# Altium project PCBA-2121-01-B02.PrjPcb
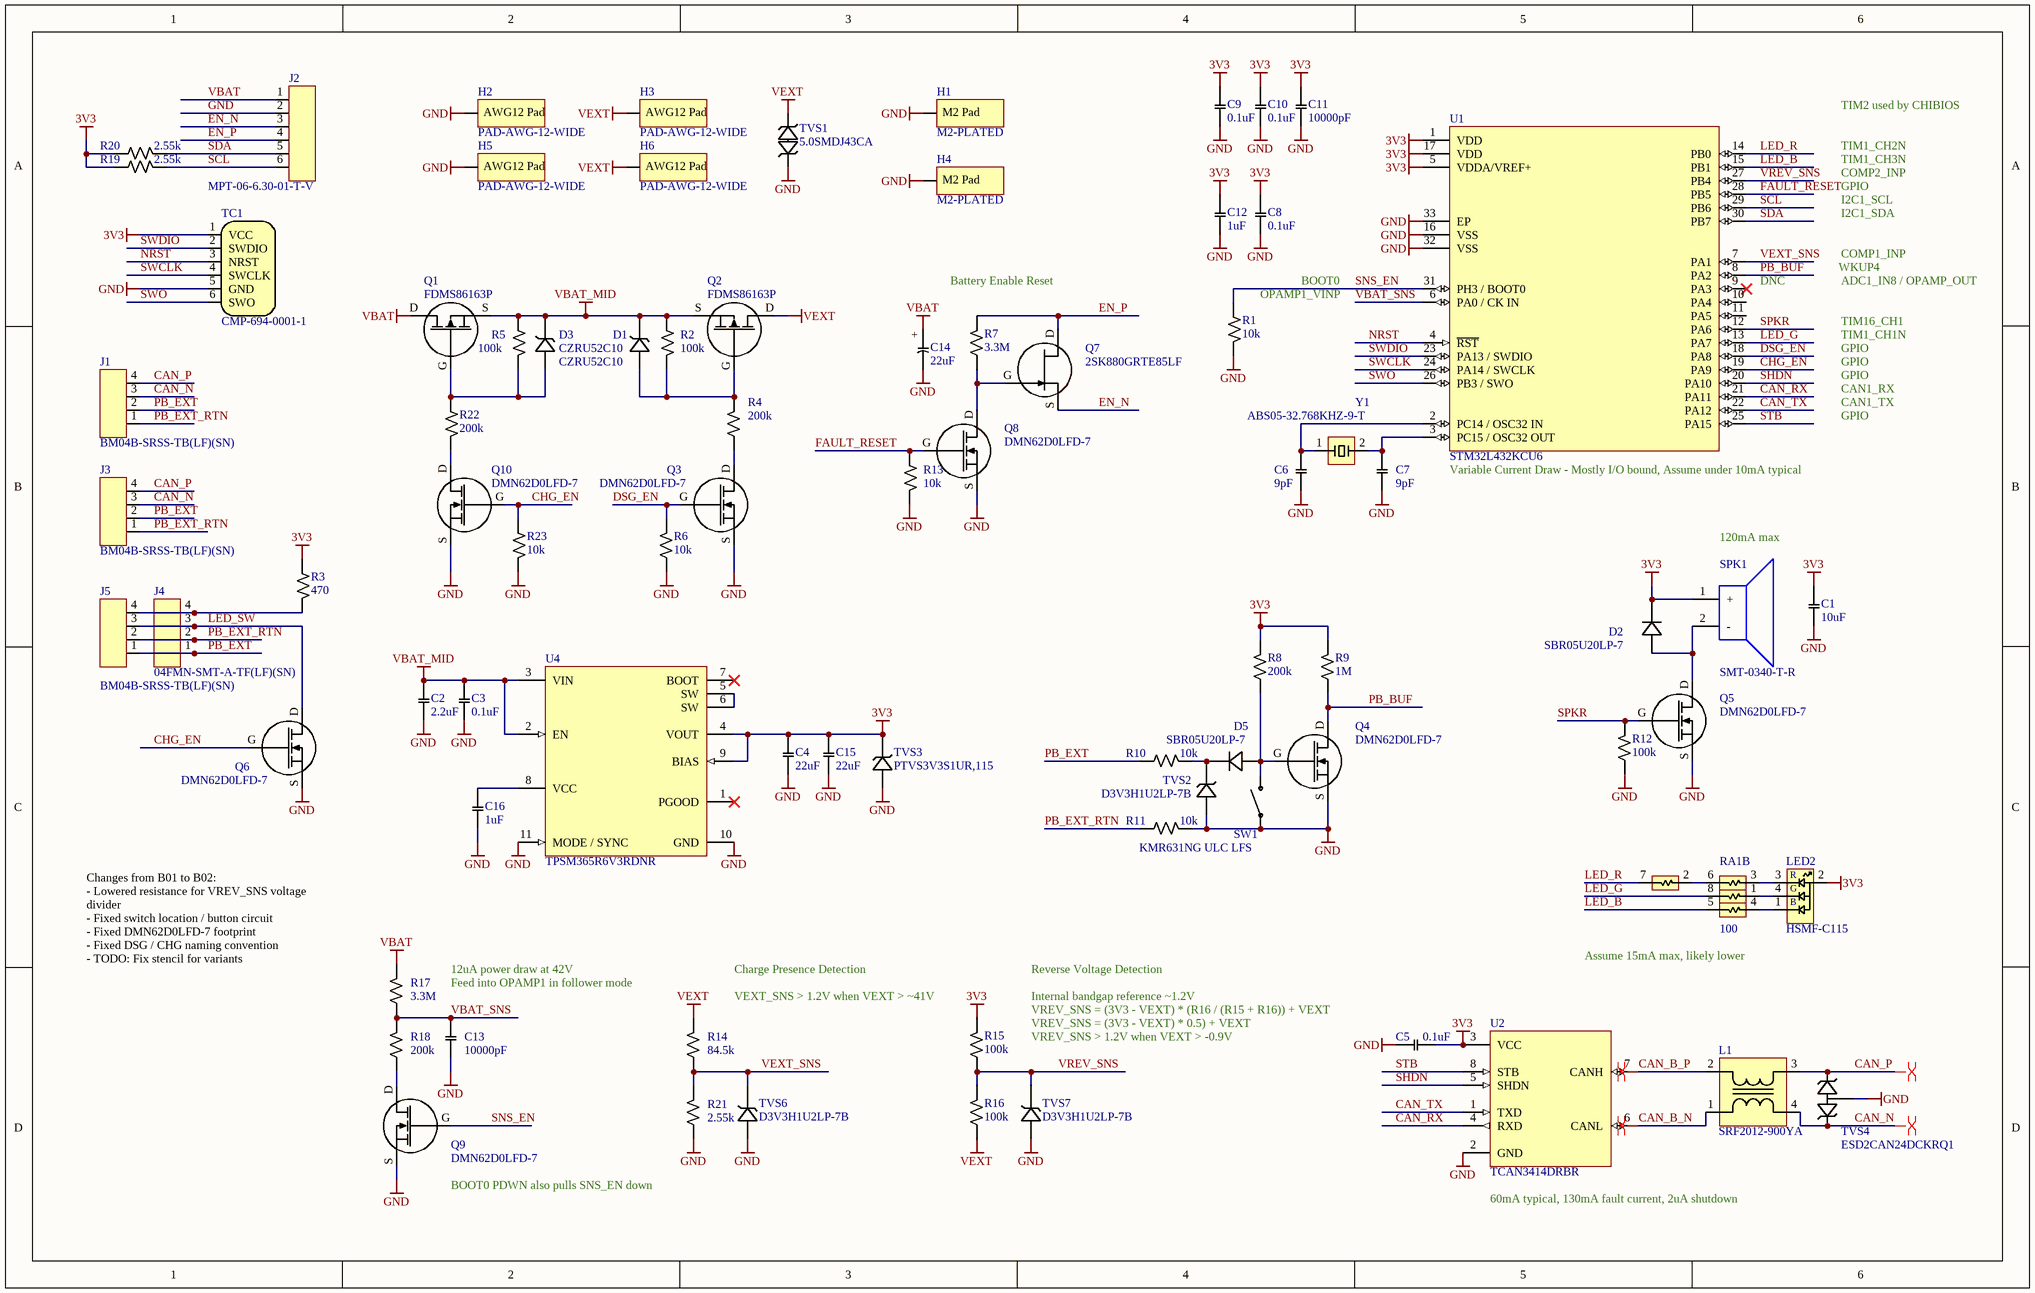
[diagram p0: PCBA-2121-01.SchDoc]
board_revision: rev A01; part_number: PE-XXXX-01
1 sheet, 80 parts. Net scope: global (net labels, ports and power ports of the same name join across sheets).
Board files: PCBA-2121-01.PcbDoc, PANEL-PCBA-2121-01.PcbDoc, PCBA-2121-01_tabbed.PcbDoc, PCBA-2121-01_v_cut.PcbDoc

## Sheet PCBA-2121-01.SchDoc
size B; Organization: Hebi Robotics; Address1: Suite 780; Address2: 5001 Baum Blvd; Address3: Pittsburgh, PA 15213; Address4: USA

### Parts
C1  Capacitance: 10uF  [C0603]  (hidden comment: C-10uf-X5R-16V-10%-0603)
C2  Capacitance: 2.2uF  [C1206]  (hidden comment: C-2.2uf-X7R-100V-10%-1206)
C3  Capacitance: 0.1uF  [C0603]  (hidden comment: C-0.1uf-X7R-100V-10%-0603)
C4  Capacitance: 22uF  [C1206]  (hidden comment: C-22uf-X5R-25V-20%-1206)
C5  Capacitance: 0.1uF  [C0402]  (hidden comment: C-0.1uf-X7R-25V-10%-0402)
C6  Capacitance: 9pF  [C0402]  (hidden comment: C-9pf-NP0-50V-0.1pF-0402)
C7  Capacitance: 9pF  [C0402]  (hidden comment: C-9pf-NP0-50V-0.1pF-0402)
C8  Capacitance: 0.1uF  [C0402]  (hidden comment: C-0.1uf-X7R-25V-10%-0402)
C9  Capacitance: 0.1uF  [C0402]  (hidden comment: C-0.1uf-X7R-25V-10%-0402)
C10  Capacitance: 0.1uF  [C0402]  (hidden comment: C-0.1uf-X7R-25V-10%-0402)
C11  Capacitance: 10000pF  [C0402]  (hidden comment: C-10000pf-X7R-50V-10%-0402)
C12  Capacitance: 1uF  [C0402]  (hidden comment: C-1uf-X5R-25V-10%-0402)
C13  Capacitance: 10000pF  [C0402]  (hidden comment: C-10000pf-X7R-50V-10%-0402)
C14  Capacitance: 22uF  [CAPAE5753X61L]  (hidden comment: UCM1H220MCL1GS)
C15  Capacitance: 22uF  [C1206]  (hidden comment: C-22uf-X5R-25V-20%-1206)
C16  Capacitance: 1uF  [C0402]  (hidden comment: C-1uf-X5R-25V-10%-0402)
D1  CZRU52C10  [CZRU52C10]
D2  SBR05U20LP-7  [DFN1006-2_DIODES]
D3  CZRU52C10  [CZRU52C10]
D5  SBR05U20LP-7  [DFN1006-2_DIODES]
H1  M2-PLATED  [M2-PLATED-NORMAL]  (no BOM)
H2  PAD-AWG-12-WIDE  [AWG-12-With-Wire]  (no BOM)
H3  PAD-AWG-12-WIDE  [AWG-12-With-Wire]  (no BOM)
H4  M2-PLATED  [M2-PLATED-NORMAL]  (no BOM)
H5  PAD-AWG-12-WIDE  [AWG-12-With-Wire]  (no BOM)
H6  PAD-AWG-12-WIDE  [AWG-12-With-Wire]  (no BOM)
J1  BM04B-SRSS-TB(LF)(SN)  [BM04B-SRSS-TB]
J2  MPT-06-6.30-01-T-V  [MPT-06-6.30-01-T-V-Footprint-1]
J3  BM04B-SRSS-TB(LF)(SN)  [BM04B-SRSS-TB]
J4  04FMN-SMT-A-TF(LF)(SN)  [04FMN-SMT-A-TF(LF)(SN)-Footprint-1]
J5  BM04B-SRSS-TB(LF)(SN)  [BM04B-SRSS-TB]
L1  SRF2012-900YA  [FP-SRF2012A-MFG]
LED2  HSMF-C115  [HSMF-C115]
Q1  FDMS86163P  [FDMS86300DC]
Q2  FDMS86163P  [FDMS86300DC]
Q3  DMN62D0LFD-7  [DMN62D0LFD-7-Footprint-1]
Q4  DMN62D0LFD-7  [DMN62D0LFD-7-Footprint-1]
Q5  DMN62D0LFD-7  [DMN62D0LFD-7-Footprint-1]
Q6  DMN62D0LFD-7  [DMN62D0LFD-7-Footprint-1]
Q7  2SK880GRTE85LF  [SOT65P205X100-3L]
Q8  DMN62D0LFD-7  [DMN62D0LFD-7-Footprint-1]
Q9  DMN62D0LFD-7  [DMN62D0LFD-7-Footprint-1]
Q10  DMN62D0LFD-7  [DMN62D0LFD-7-Footprint-1]
R1  Resistance: 10k  [R0402]  (hidden comment: R-10k-1%-0.063w-0402)
R2  Resistance: 100k  [R0402]  (hidden comment: R-100k-1%-0.063w-0402)
R3  Resistance: 470  [R0402]  (hidden comment: R-470-1%-0.063w-0402)
R4  Resistance: 200k  [R0402]  (hidden comment: R-200k-1%-0.063w-0402)
R5  Resistance: 100k  [R0402]  (hidden comment: R-100k-1%-0.063w-0402)
R6  Resistance: 10k  [R0402]  (hidden comment: R-10k-1%-0.063w-0402)
R7  Resistance: 3.3M  [R0402]  (hidden comment: R-3.3M-1%-0.063w-0402)
R8  Resistance: 200k  [R0402]  (hidden comment: R-200k-1%-0.063w-0402)
R9  Resistance: 1M  [R0402]  (hidden comment: R-1M-1%-0.063w-0402)
R10  Resistance: 10k  [R0402]  (hidden comment: R-10k-1%-0.063w-0402)
R11  Resistance: 10k  [R0402]  (hidden comment: R-10k-1%-0.063w-0402)
R12  Resistance: 100k  [R0402]  (hidden comment: R-100k-1%-0.063w-0402)
R13  Resistance: 10k  [R0402]  (hidden comment: R-10k-1%-0.063w-0402)
R14  Resistance: 84.5k  [R0402]  (hidden comment: R-84.5k-1%-0.063w-0402)
R15  Resistance: 100k  [R0402]  (hidden comment: R-100k-1%-0.063w-0402)
R16  Resistance: 100k  [R0402]  (hidden comment: R-100k-1%-0.063w-0402)
R17  Resistance: 3.3M  [R0402]  (hidden comment: R-3.3M-1%-0.063w-0402)
R18  Resistance: 200k  [R0402]  (hidden comment: R-200k-1%-0.063w-0402)
R19  Resistance: 2.55k  [R0402]  (hidden comment: R-2.55k-1%-0.063w-0402)
R20  Resistance: 2.55k  [R0402]  (hidden comment: R-2.55k-1%-0.063w-0402)
R21  Resistance: 2.55k  [R0402]  (hidden comment: R-2.55k-1%-0.063w-0402)
R22  Resistance: 200k  [R0402]  (hidden comment: R-200k-1%-0.063w-0402)
R23  Resistance: 10k  [R0402]  (hidden comment: R-10k-1%-0.063w-0402)
RA1  RA-4-C-100-5%-0.063w-0804  [741C083]  (value not drawn)  (parts A,B,C,D of 4)
SPK1  SMT-0340-T-R  [SMT-0340-T-R]
SW1  KMR631NG ULC LFS  [KMR6_CK]
TC1  CMP-694-0001-1  [TC2030-MCP-NL_SMALL]  (no BOM)
TVS1  5.0SMDJ43CA  [DIOM6959X26L]
TVS2  D3V3H1U2LP-7B  [DFN70P101X53-2N]
TVS3  PTVS3V3S1UR,115  [SOD-123W_NXP]
TVS4  ESD2CAN24DCKRQ1  [SOT65P210X90-3L]
TVS6  D3V3H1U2LP-7B  [DFN70P101X53-2N]
TVS7  D3V3H1U2LP-7B  [DFN70P101X53-2N]
U1  STM32L432KCU6  [QFN50P500X500X60_HS-33L]
U2  TCAN3414DRBR  [SON65P300X100_HS-9L]
U4  TPSM365R6V3RDNR  [TPSM365R6V3RDNR-Footprint-1]
Y1  ABS05-32.768KHZ-9-T  [ABS05-32.768KHZ-9-T-Footprint-1]

### Nets
3V3: C1.1 C4.2 C5.2 C8.2 C9.2 C10.2 C11.2 C12.1 C15.2 D2.C LED2.2(A) R3.1 R8.2 R9.2 R15.2 R19.1 R20.1 SPK1.1(+) TC1.1(VCC) TVS3.C U1.1(VDD) U1.5(VDDA/VREF+) U1.17(VDD) U2.3(VCC) U4.4(VOUT) U4.9(BIAS)
GND: C1.2 C2.1 C3.1 C4.1 C5.1 C6.1 C7.1 C8.1 C9.1 C10.1 C11.1 C12.2 C13.2 C14.- C15.1 C16.1 H1.HOLE H2.HOLE H4.HOLE H5.HOLE J2.2 Q3.S Q4.S Q5.S Q6.S Q8.S Q9.S Q10.S R1.2 R6.1 R11.2 R12.1 R13.2 R21.1 R23.1 SW1.1 TC1.5(GND) TVS1.C TVS2.A TVS3.A TVS4.3 TVS6.A TVS7.A U1.16(VSS) U1.32(VSS) U1.33(EP) U2.2(GND) U4.10(GND) U4.11(MODE_/_SYNC)
VBAT: C14.+ J2.1 Q1.D R17.2
VBAT_MID: C2.2 C3.2 D1.C D3.C Q1.S Q2.S R2.1 R5.1 U4.2(EN) U4.3(VIN)
VEXT: H3.HOLE H6.HOLE Q2.D R14.2 R16.1 TVS1.A
CAN_B_N: L1.1 U2.6(CANL)
CAN_B_P: L1.2 U2.7(CANH)
CAN_N: J1.3 J3.3 L1.4 TVS4.2
CAN_P: J1.4 J3.4 L1.3 TVS4.1
CAN_RX: U1.21(PA11) U2.4(RXD)
CAN_TX: U1.22(PA12) U2.1(TXD)
CHG_EN: Q6.G Q10.G R23.2 U1.19(PA9)
DSG_EN: Q3.G R6.2 U1.18(PA8)
EN_N: J2.3 Q7.S
EN_P: J2.4 Q7.D R7.2
FAULT_RESET: Q8.G R13.1 U1.28(PB5)
LED_B: RA1.5 U1.15(PB1)
LED_G: RA1.8 U1.13(PA7)
LED_R: RA1.7 U1.14(PB0)
LED_SW: J4.3 J5.3 Q6.D
NRST: TC1.3(NRST) U1.4(~{RST})
PB_BUF: Q4.D R9.1 U1.8(PA2)
PB_EXT: J1.2 J3.2 J4.1 J5.1 R10.1
PB_EXT_RTN: J1.1 J3.1 J4.2 J5.2 R11.1
SCL: J2.6 R19.2 U1.29(PB6)
SDA: J2.5 R20.2 U1.30(PB7)
SHDN: U1.20(PA10) U2.5(SHDN)
SNS_EN: Q9.G R1.1 U1.31(PH3_/_BOOT0)
SPKR: Q5.G R12.2 U1.12(PA6)
STB: U1.25(PA15) U2.8(STB)
SWCLK: TC1.4(SWCLK) U1.24(PA14_/_SWCLK)
SWDIO: TC1.2(SWDIO) U1.23(PA13_/_SWDIO)
SWO: TC1.6(SWO) U1.26(PB3_/_SWO)
VBAT_SNS: C13.1 R17.1 R18.2 U1.6(PA0_/_CK_IN)
VEXT_SNS: R14.1 R21.2 TVS6.C U1.7(PA1)
VREV_SNS: R15.1 R16.2 TVS7.C U1.27(PB4)
NetC6_2: C6.2 U1.2(PC14_/_OSC32_IN) Y1.1
NetC7_2: C7.2 U1.3(PC15_/_OSC32_OUT) Y1.2
NetC16_2: C16.2 U4.8(VCC)
NetD1_A: D1.A Q2.G R2.2 R4.2
NetD2_A: D2.A Q5.D SPK1.2(-)
NetD3_A: D3.A Q1.G R5.2 R22.2
NetD5_A: D5.A Q4.G R8.1 SW1.2
NetD5_C: D5.C R10.2 TVS2.C
NetJ4_4: J4.4 J5.4 R3.2
NetLED2_1: LED2.1(CR) RA1.4
NetLED2_3: LED2.3(CB) RA1.3
NetLED2_4: LED2.4(CG) RA1.1
NetQ3_D: Q3.D R4.1
NetQ7_G: Q7.G Q8.D R7.1
NetQ9_D: Q9.D R18.1
NetQ10_D: Q10.D R22.1
NetRA1_2: RA1.2 RA1.6
NetU4_5: U4.5(SW) U4.6(SW)

Not connected (* = marked no-connect by the designer): U1 9(PA3)* 10(PA4) 11(PA5); U4 1(PGOOD)* 7(BOOT)*

### Layout directives
differential pair: CAN_B_N, CAN_B_P, CAN_N, CAN_P

### Notes on the sheet
- TIM1_CH3N
- TIM1_CH2N
- TIM2 used by CHIBIOS
- I2C1_SCL
- I2C1_SDA
- COMP2_INP
- GPIO
- Battery Enable Reset
- BOOT0
- OPAMP1_VINP
- (near U1) DNC
- ADC1_IN8 / OPAMP_OUT
- COMP1_INP
- WKUP4
- TIM1_CH1N
- TIM16_CH1
- CAN1_RX
- CAN1_TX
- (near U1) Variable Current Draw - Mostly I/O bound, Assume under 10mA typical
- 120mA max
- 12uA power draw at 42V
- Charge Presence Detection
- Reverse Voltage Detection
- Assume 15mA max, likely lower
- Feed into OPAMP1 in follower mode
- VEXT_SNS > 1.2V when VEXT > ~41V
- VREV_SNS > 1.2V when VEXT > -0.9V
- VREV_SNS = (3V3 - VEXT) * (R16 / (R15 + R16)) + VEXT
- VREV_SNS = (3V3 - VEXT) * 0.5) + VEXT
- Internal bandgap reference ~1.2V
- Changes from B01 to B02:
  - Lowered resistance for VREV_SNS voltage divider
  - Fixed switch location / button circuit
  - Fixed DMN62D0LFD-7 footprint
  - Fixed DSG / CHG naming convention
  - TODO: Fix stencil for variants
- (near Q9) BOOT0 PDWN also pulls SNS_EN down
- (near U2) 60mA typical, 130mA fault current, 2uA shutdown
- Title
- Size:
- Date:
- Tabloid
- Number:
- Time:
- Revision:
- Sheet
- of
- File:
- (in symbol CMP-00909-1) R; G; B

### Library data of the parts
C1 = CMP-00102-2: Capacitor Ceramic 10uF 16V X5R 10% SMD 0603; Tolerance: 10%; Voltage - Rated: 16V; Package / Case: 0603; Operating Temperature: -55°C ~ 85°C; Temperature Coefficient: X5R
C2 = CMP-01086-1: Capacitor Ceramic 2.2uF 100V X7R 10% SMD 1206; Package / Case: 1206; Voltage - Rated: 100V; Operating Temperature: -55°C ~ 125°C; Temperature Coefficient: X7R; Tolerance: ±10%
C3 = C-0.1uf-X7R-100V-20%-0603-6: Capacitor Ceramic 0.1uF 100V X7R 10% SMD 0603; Operating Temperature: -55°C ~ 125°C; Voltage - Rated: 100V; Tolerance: ±10%; Temperature Coefficient: X7R; Package / Case: 0603
C4 C15 = CMP-00094-2: Capacitor Ceramic 22uF 25V X5R 20% SMD 1206; Package / Case: 1206; Voltage - Rated: 25V; Tolerance: 20%; Operating Temperature: -55°C ~ 85°C; Temperature Coefficient: X5R
C5 C8-C10 = CMP-00040-11: Capacitor Ceramic 0.1uF 25V X7R 10% SMD 0402; Voltage - Rated: 25V; Package / Case: 0402; Operating Temperature: -55°C ~ 125°C; Temperature Coefficient: X7R; Tolerance: 10%
C6 C7 = CMP-01105-1: Capacitor Ceramic 9pF 50V NP0 ±0.1pF SMD 0402; Temperature Coefficient: C0G, NP0; Package / Case: 0402; Operating Temperature: -55°C ~ 125°C; Tolerance: ±0.1pF; Voltage - Rated: 50V
C11 C13 = CMP-00041-8: Capacitor Ceramic 10000pF 50V X7R 10% SMD 0402; Voltage - Rated: 50V; Operating Temperature: -55°C ~ 125°C; Tolerance: 10%; Temperature Coefficient: X7R; Package / Case: 0402
C12 C16 = C-1uf-X5R-25V-10%-0402-8: Capacitor Ceramic 1uF 25V X5R 10% SMD 0402; Tolerance: ±10%; Voltage - Rated: 25V; Package / Case: 0402; Operating Temperature: -55°C ~ 85°C; Temperature Coefficient: X5R
C14 = CMP-01106-1: CAP ALUM 22UF 20% 50V SMD; Capacitor Type: Aluminium; Tolerance: 20%; Voltage: 50V
D1 D3 = CMP-00843-2: DIODE ZENER 10V 150MW 0603; Test Current: 5mA; Diode Element Material: SILICON; Number of Terminals/Pins: 2; Number of Elements: 1; Voltage Tol-Max: 5%; Package Body Material: Plastic; Time @ Peak Reflow Temperature-Max (s): 30s; Polarity: Unidirectional; Min Operating Temperature: -55°C; Max Power Dissipation: 150mW; RoHS Compliant: Yes; Max Operating Temperature: 125°C; Reference Voltage-Nom: 10V; Terminal Finish: Gold; Terminal Position: DUAL; Terminal Form: No Lead; Package Shape: Rectangular; Surface Mount: Yes; Diode Type: ZENER; Peak Reflow Temperature (Cel): 260°C; Technology: ZENER; REACH SVHC: Yes; JESD-609 Code: e4; Package Style: SMALL OUTLINEMeter
D2 D5 = CMP-698-0003-3: DIODE SBR 20V 500MA 2DFN; Speed: Fast Recovery =< 500ns, > 200mA (Io); Voltage - Forward (Vf) (Max) @ If: 500mV @ 500mA; Current - Reverse Leakage @ Vr: 50µA @ 20V; Diode Type: Super Barrier; Supplier Device Package: 2-DFN1006 (1.0x0.6); Current - Average Rectified (Io): 500mA; Lead Free Status / RoHS Status: RoHS Compliant; Category: Discrete Semiconductor Products; ComponentLink1URL: http://www.diodes.com/datasheets/SBR05U20LP.pdf; ComponentLink1Description: Datasheet; Mounting Type: Surface Mount; Capacitance @ Vr, F: -; Reverse Recovery Time (trr): -; Voltage - DC Reverse (Vr) (Max): 20V; Operating Temperature - Junction: -65°C ~ 150°C; Package / Case: 2-UFDFN
H1 H4 = CMP-00782-1: M2 Size Screw Hole, Normal Fit, Plated; Size: M2
H2 H3 H5 H6 = CMP-01047-1: AWG 12 Hole with Wider Pad; Size: AWG12
J1 J3 = CMP-00286-2: CONN HEADER SH 4POS TOP 1MM TIN; Manufacturer: JST Sales America Inc; Connector Type: Header, Shrouded; Number of Positions Loaded: All; Number of Positions: 4; Pitch: 0.039" (1.00mm); Features: Solder Retention; Mounting Type: Surface Mount; Color: Natural; Contact Finish: Tin; Row Spacing: -; ComponentLink1URL: http://www.jst-mfg.com/product/pdf/eng/eSH.pdf; Contact Mating Length: -; ComponentLink1Description: Datasheet; Contact Finish Thickness: -; Manufacturer Part Number: BM04B-SRSS-TB(LF)(SN); Number of Rows: 1; Category: Connectors, Interconnects; Lead Free Status / RoHS Status: RoHS Compliant; Contact Type: Male Pin; Termination: Solder; Fastening Type: -
J2 = CMP-00921-2: 5.00 MM POWERSTRIP/30 A DUAL BL; Number of Terminals/Pins: 36; Number of Ports: 1; Number of Contacts: 6; Voltage Rating: 812V; Gender: Male; Contact Plating: Tin; Housing Material: Polymer; Series: PowerStrip™ 30 MPT; Packaging: Tray; Number of Positions: 6; Termination: Solder; Number of Rows: 1; Mount: Through Hole; Insulation Material: Polymer; Contact Material: Copper Alloy; Length: 37.55mm; Orientation: Straight; Fastening Type: Ramp; Max Operating Temperature: 105°C; Min Operating Temperature: -55°C; Depth: 12.45mm; RoHS Compliant: Yes; Number of Pins: 36; Color: Black; Radiation Hardening: No
J4 = CMP-1199-000014-1: Ffc / Fpc Board Connector, Fmn Series, Surface Mount, Receptacle, 4, 1 Mm Rohs Compliant: Yes; Max Current Rating: 500mA; Number of Positions: 4; Pitch: 1mm; Max Voltage Rating (DC): 50V; Max Operating Temperature: 85°C; Orientation: Right Angle; Min Operating Temperature: -25°C; Mounting Technology: Surface Mount
J5 = CMP-00286-2: CONN HEADER SH 4POS TOP 1MM TIN; Manufacturer: JST Sales America Inc; Connector Type: Header, Shrouded; Number of Positions: 4; Number of Positions Loaded: All; Pitch: 0.039" (1.00mm); Manufacturer Part Number: BM04B-SRSS-TB(LF)(SN); Lead Free Status / RoHS Status: RoHS Compliant; ComponentLink1Description: Datasheet; ComponentLink1URL: http://www.jst-mfg.com/product/pdf/eng/eSH.pdf; Category: Connectors, Interconnects; Contact Type: Male Pin; Number of Rows: 1; Mounting Type: Surface Mount; Termination: Solder; Features: Solder Retention; Contact Finish: Tin; Color: Natural; Contact Mating Length: -; Fastening Type: -; Row Spacing: -; Contact Finish Thickness: -
L1 = CMP-01087-1: CMC 400MA 2LN 90 OHM SMD; DC Resistance-Max: 300mR; Filter Type: DATA LINE FILTER; Voltage Rating: 50V; Output Impedance: 90R; Width: 1.2mm; Current Rating: 400mA; Mounting Technology: Surface Mount; Length: 2mm; RoHS Compliant: Yes; Height: 1.2mm; Min Operating Temperature: -40°C; Max Operating Temperature: 125°C; Reach SVHC Compliant: Yes
LED2 = CMP-00909-1: LED RGB DIFFUSED CHIP SMD R/A; Test Current: 20mA; Dominant Wavelength: 470nm; Viewing Angle: 125°; Number of LEDs: 3; Power Rating: 78mW; Reverse Voltage: 5V; Lens Color: White; Lens Style: Diffused,Dome,Colorless,Rectangular; Color: Blue,Green,Red; Luminous Intensity: 60mcd; Forward Voltage: 3.4V; RoHS Compliant: Yes; Height: 1mm; Mount: Surface Mount; Min Operating Temperature: -40°C; Forward Current: 20mA; Radiation Hardening: No; Wavelength: 470nm; Number of Pins: 4; Lens Transparency: Diffused; Package Quantity: 3000; REACH SVHC: No SVHC; Width: 1mm; Contact Plating: Gold; Case/Package: SMD/SMT; Lead Free: Lead Free; Length: 2.5mm; Depth: 1mm; Number of Elements: 3; Max Operating Temperature: 85°C; Packaging: Tape and Reel; Series: -
Q1 Q2 = CMP-00940-2: MOSFET P-CH 100V 7.9A POWER56; Drain to Source Voltage (Vdss): -100V; Continuous Drain Current (ID): -50A; Drain to Source Resistance: 22mR; Element Configuration: Single; Gate to Source Voltage (Vgs): 25V; Max Power Dissipation: 104W; Threshold Voltage: -2.8V; Height: 1.05mm; Length: 5mm; Max Operating Temperature: 150°C; Min Operating Temperature: -55°C; Rds On Max: 22mR; Width: 5.85mm
Q3-Q6 Q8-Q10 = CMP-01107-2: MOSFET N-CH 60V 310MA 3DFN
Q7 = CMP-01103-1: JFET N-CH 50V SC70
R1 R6 R10 R11 R13 R23 = CMP-00015-10: Resistor 0402 10k Ohm 1% 1-16 Watt; Power: 0.063W, 1/16W; Package: 0402; Tolerance: 1%
R2 R5 R12 R15 R16 = CMP-00014-5: Resistor 0402 100k Ohm 1% 1-16 Watt; Power: 0.063W, 1/16W; Package: 0402; Tolerance: 1%
R3 = CMP-00097-2: Resistor 0402 470 Ohm 1% 1-16 Watt; Power: 0.063W, 1/16W; Package: 0402; Tolerance: 1%
R4 R8 R18 R22 = CMP-00010-6: Resistor 0402 200k Ohm 1% 1-16 Watt; Power: 0.063W, 1/16W; Tolerance: 1%; Package: 0402
R7 R17 = CMP-00141-5: Resistor 0402 3.3M Ohm 1% 1-16 Watt; Power: 0.063W, 1/16W; Package / Case: 0402; Tolerance (%): ±1%
R9 = CMP-00025-6: Resistor 0402 1M Ohm 1% 1-16 Watt; Power: 0.063W, 1/16W; Package: 0402; Tolerance: 1%
R14 = CMP-00979-1: Resistor 0402 84.5k Ohm 1% 1-16 Watt; Part Name: R-82k-1%-0.063w-0402; Power: 0.063W, 1/16W; Package / Case: 0402; Tolerance (%): ±1%
R19-R21 = CMP-00113-3: Resistor 0402 2.55k Ohm 1% 1-16 Watt; Power: 0.063W, 1/16W; Tolerance (%): ±1%; Package / Case: 0402; Part Name: R-2.55k-1%-0.063w-0402
RA1 = CMP-340-0000-6: 100 ohm Resistor Array 4 Element Concave 5%  1-16Watt 0804; Circuit Type: Isolated; Number of Resistors: 4; Power: 0.063W; Resistance: 100; Number of Pins: 4; Package / Case: 0804, Concave, Long Side Terminals; Part Name: RA-4-C-100-5%-0.063w-0804; Tolerance (%): ±5%; Terminal Style: Long Side
SPK1 = CMP-00933-2: BUZZER MAGNETIC 3V 3.2X3.2MM SMD; Frequency: 4kHz; Current: 120mA; Voltage: 3V
SW1 = CMP-00539-1: SWITCH TACTILE SPST-NO 50MA 32V; Manufacturer: ITT C&K; Operating Force: 300gf; Switch Function: Off-Mom; Mechanical Life: 150000Cycles; Throw Configuration: SPST; Actuator Type: Standard; Illumination Type: Non-Illuminated; Mount: Surface Mount; Min Operating Temperature: -40°C; Manufacturer Part Number: KMR631NG ULC LFS; Max Operating Temperature: 85°C; Termination: Gull Wing
TC1 = CMP-694-0001-1: TC2030-MCP-NL; Manufacturer Part Number: TC2030-MCP-NL_SMALL
TVS1 = CMP-01029-1: TVS DIODE 43VWM 69.4VC DO214AB; Min Breakdown Voltage: 47.8V; Clamping Voltage: 69.4V; Peak Pulse Power: 5kW; Peak Pulse Current: 72.1A; Number of Bidirectional Channels: 1; Reverse Standoff Voltage: 43V; Power Line Protection: No; Diode Type: ZENER; Leakage Current: 5uA; Test Current: 1mA; Polarity: Bidirectional; Min Operating Temperature: -55°C; Max Operating Temperature: 150°C; RoHS Compliant: Yes; Packaging: Tape and Reel; Series: 5.0SMDJ; Package Quantity: 3000; Mounting Technology: Surface Mount; Breakdown Voltage: 47.8V; Number of Elements: 1; Number of Channels: 1; Pins: 2; Case/Package: DO-214AB; Operating Supply Voltage: 43V; Reverse Breakdown Voltage: 47.8V; Max Surge Current: 72.1A; Termination: SMD/SMT
TVS2 TVS6 TVS7 = CMP-00666-2: TVS DIODE 3.3V 10V DFN1006-2; RoHS Compliant: Yes
TVS3 = CMP-00447-5: TVS DIODE 3.3VWM 8VC SOD123W; Unidirectional Channels: 1; Voltage - Clamping (Max) @ Ipp: 8V; Power - Peak Pulse: 400W; Power Line Protection: No; Current - Peak Pulse (10/1000µs): 43.8A; Voltage - Breakdown (Min): 5.2V; Voltage - Reverse Standoff (Typ): 3.3V; Lead Free Status / RoHS Status: RoHS Compliant; ComponentLink1URL: http://www.nxp.com/documents/data_sheet/PTVSXS1UR_SER.pdf; Package / Case: SOD-123W; Mounting Type: Surface Mount; Category: Circuit Protection; ComponentLink1Description: Datasheet; Bidirectional Channels: -; Capacitance @ Frequency: -; Operating Temperature: -55°C ~ 150°C (TA); Applications: Automotive; Supplier Device Package: SOD123W; Type: Zener
TVS4 = CMP-01080-1: TVS DIODE 24VWM 37VC CAN SC703
U1 = CMP-01102-1: IC MCU 32BIT 256KB FLSH 32UFQFPN; Core Architecture: ARM; Number of I/Os: 26; Oscillator Type: Internal; Peripherals: Brown-out Detect/Reset,PWM,WDT,DMA; Interface: CANbus, I2C, IrDA, LINbus, QSPI, SAI, SPI, SWPMI, UART/USART; Min Operating Temperature: -40°C; Max Operating Temperature: 85°C; RoHS Compliant: Yes; Mounting Technology: Surface Mount; Series: STM32L4; Case/Package: UFQFPN
U2 = CMP-01078-3: IC TRANSCEIVER HALF 1/1 8SON; pin to pad: 2>2+9
U4 = CMP-01085-2: 3-V TO 65-V INPUT, 3V3 OUT, 300mA
Y1 = CMP-01104-1: CRYSTAL 32.7680KHZ 9PF SMD; Manufacturer Series: ABS05; Frequency Stability: 0.0072%; Additional Feature: TAPE AND REEL; Frequency Tolerance: 20ppm; Drive Level: 0.5uW; ESR: 90kR; Crystal/Resonator Type: PARALLEL - FUNDAMENTAL; Operating Frequency-Nom: 0.032768; Max Operating Temperature: 85°C; RoHS Compliant: Yes; Load Capacitance: 9pF; Mounting Technology: Surface Mount; Reach SVHC Compliant: Yes; Min Operating Temperature: -40°C

## Assembly variants
CAP: not fitted J5
BUTTON: not fitted J4